# EAGLE design QWIIC (EAGLE 9.5.0)
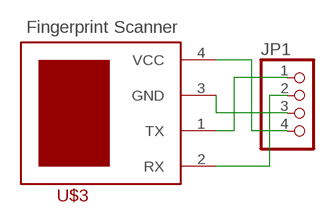
[diagram p0: schematic, sheet 1]

## Parts
JP1  PINHD-1X4  [1X04]
U$3  FPSQWIIC  [1X04_1MM_RA]

## Nets
N$1: JP1.2 U$3.2(RX)
N$2: JP1.3 U$3.3(GND)
N$3: JP1.4 U$3.4(VCC)
N$4: JP1.1 U$3.1(TX)

## Notes on the sheet
- Fingerprint Scanner

## Library data of the parts
JP1 = pinhead:PINHD-1X4: PIN HEADER
U$3 = cool_safe_lib:FPS

## Module SWITCHINGMODULE
Ports: 

### Library data of the parts

## Board
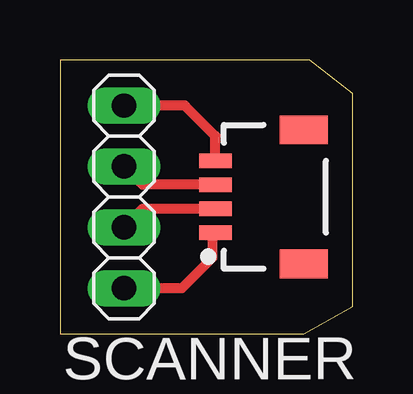
[diagram p1: board, top side]

Size 12.19 x 11.43 mm. Coordinates in mm from the lower left corner, seen from the top.
Outline: 0,0 10.16,0 12.19,1.14 12.19,10.03 10.41,11.43 0,11.43 0,0
Copper layers (1*16): Top 0.035mm / dielectric 1.5mm / Bottom 0.035mm
Design rules "default": minimum track width 6mil, minimum drill 0.35mm, track to track 6mil, track to pad 6mil, pad to pad 6mil, via to via 6mil, smd to smd 6mil, copper to edge 40mil, drill to drill 6mil, minimum pad ring 10mil, minimum via ring 8mil, stop-mask expansion 4mil, vias tented up to drill 0mil, thermal gap 10mil

### Footprints (pad centres in the part's own frame; a part is rotated, then mirrored left to right if it is on the bottom)
1X04 = drill 1.016 long: 1 -3.81,0; 2 -1.27,0; 3 1.27,0; 4 3.81,0
1X04_1MM_RA = smd 0.6 x 1.35: 1 -1.5,0; 2 -0.5,0; 3 0.5,0; 4 1.5,0 | smd 1.2 x 2: NC1 2.8,-3.675; NC2 -2.8,-3.675

### Placement (x,y rotation side)
JP1  2.67,5.71 90 top
U$3  6.48,5.71 90 top

### Tracks (layer width: path | path; a pad name or v marks a point on that pad's centre or on a via)
N$1
  Top 0.406: U$3.2 3.44,5.21 JP1.2
N$2
  Top 0.406: U$3.3 6.47,6.22 3.43,6.22 JP1.3
N$3
  Top 0.406: U$3.4 6.48,8.26 5.21,9.53 JP1.4
N$4
  Top 0.406: U$3.1 6.35,4.09 6.35,3.17 5.08,1.91 JP1.1

### Text on the board
tNames: SCANNER